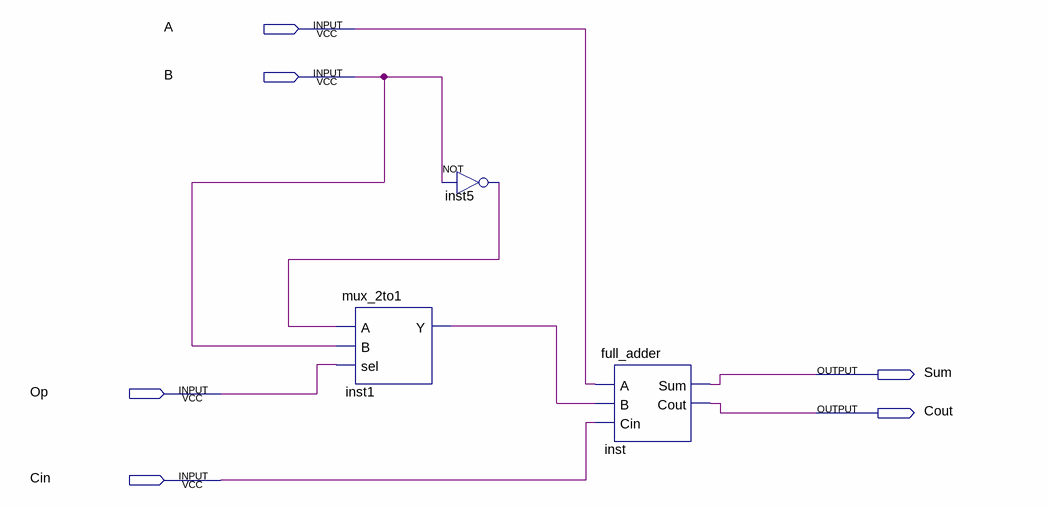
[diagram p0: schematic sheet]
// Quartus schematic add_sub1.bdf as structural Verilog: 3 symbols, 6 pins
module add_sub1 (
  input  A,
  input  B,
  input  Op,
  input  Cin,
  output Sum,
  output Cout
);

  wire inst1_y, inst5_out;

  mux_2to1 inst1 (.A(inst5_out), .B(B), .sel(Op), .Y(inst1_y));
  not inst5 (inst5_out, B);
  full_adder inst (.A(A), .B(inst1_y), .Cin(Cin), .Sum(Sum), .Cout(Cout));
endmodule
